# EAGLE schematic helium_pa3 (EAGLE 4.09)
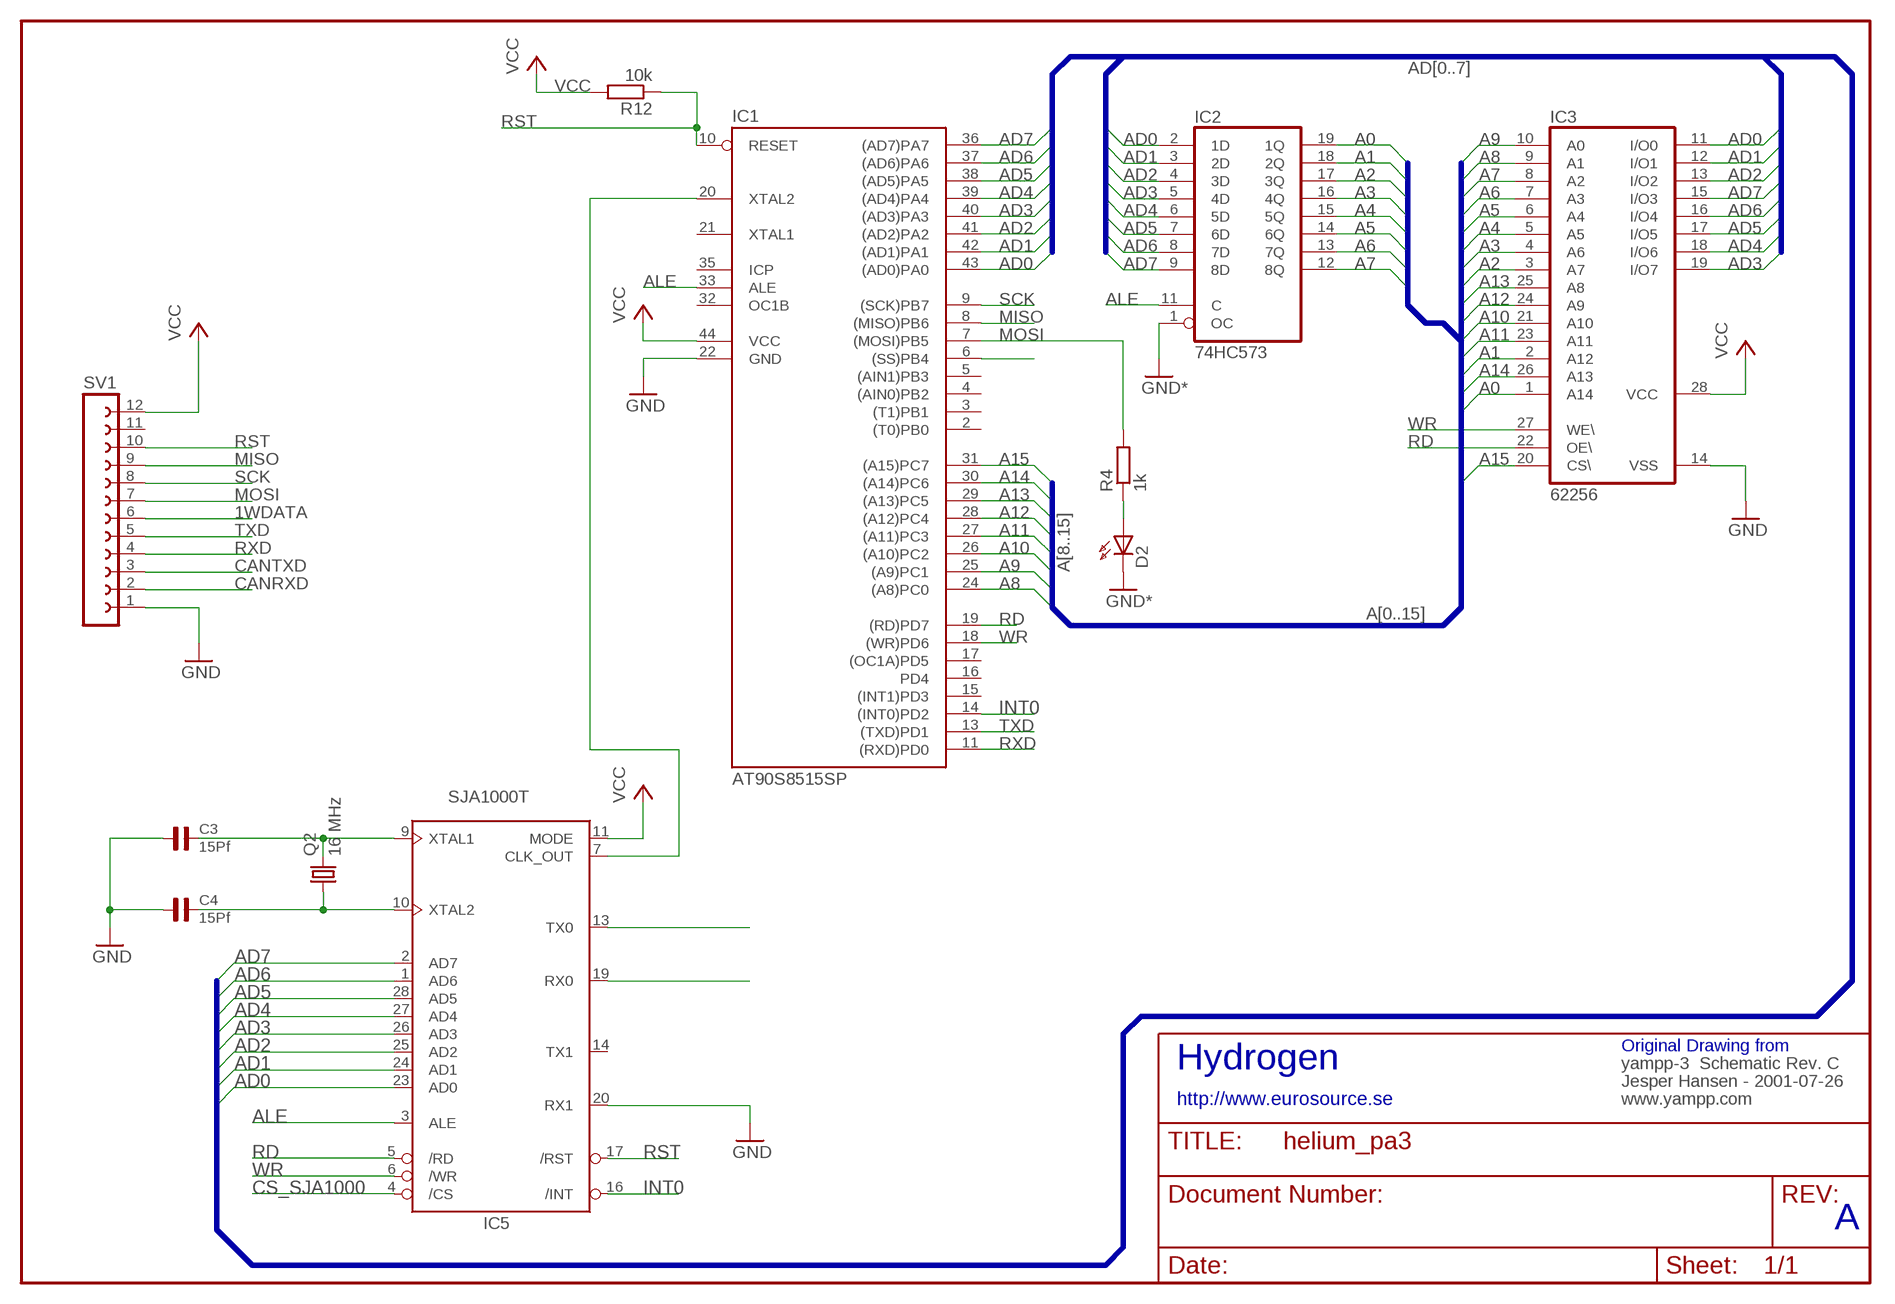
[diagram p0: schematic, sheet 1]

## Parts
C3  15Pf  C0805  [C0805]
C4  15Pf  C0805  [C0805]
D2  EL17-21LED0805  [LED0805]
IC1  AT90S8515SP  [PLCC-44-JESPER]
IC2  74HC573  74573  [SO20L]
IC3  62256  62256P  [SO28L]
IC5  SJA1000T  [SO-28L]
Q2  16 MHz  CRYTALHC49S  [HC49/S]
R4  1k  R-EU_M0805  [M0805]
R12  10k  R-EU_M0805  [M0805]
SV1  FE12-1  [FE12]

## Nets
1WDATA: SV1.6
A0: IC2.19(1Q) IC3.1(A14)
A1: IC2.18(2Q) IC3.2(A12)
A2: IC2.17(3Q) IC3.3(A7)
A3: IC2.16(4Q) IC3.4(A6)
A4: IC2.15(5Q) IC3.5(A5)
A5: IC2.14(6Q) IC3.6(A4)
A6: IC2.13(7Q) IC3.7(A3)
A7: IC2.12(8Q) IC3.8(A2)
A8: IC1.24((A8)PC0) IC3.9(A1)
A9: IC1.25((A9)PC1) IC3.10(A0)
A10: IC1.26((A10)PC2) IC3.21(A10)
A11: IC1.27((A11)PC3) IC3.23(A11)
A12: IC1.28((A12)PC4) IC3.24(A9)
A13: IC1.29((A13)PC5) IC3.25(A8)
A14: IC1.30((A14)PC6) IC3.26(A13)
A15: IC1.31((A15)PC7) IC3.20(CS\)
AD0: IC1.43((AD0)PA0) IC2.2(1D) IC3.11(I/O0) IC5.23(AD0)
AD1: IC1.42((AD1)PA1) IC2.3(2D) IC3.12(I/O1) IC5.24(AD1)
AD2: IC1.41((AD2)PA2) IC2.4(3D) IC3.13(I/O2) IC5.25(AD2)
AD3: IC1.40((AD3)PA3) IC2.5(4D) IC3.19(I/O7) IC5.26(AD3)
AD4: IC1.39((AD4)PA4) IC2.6(5D) IC3.18(I/O6) IC5.27(AD4)
AD5: IC1.38((AD5)PA5) IC2.7(6D) IC3.17(I/O5) IC5.28(AD5)
AD6: IC1.37((AD6)PA6) IC2.8(7D) IC3.16(I/O4) IC5.1(AD6)
AD7: IC1.36((AD7)PA7) IC2.9(8D) IC3.15(I/O3) IC5.2(AD7)
ALE: IC1.33(ALE) IC2.11(C) IC5.3(ALE)
CANRXD: SV1.2
CANTXD: SV1.3
CS_SJA1000: IC1.6((SS)PB4) IC5.4(/CS)
GND [power]: C3.1 C4.1 D2.2(C) IC2.1(OC) IC3.14(VSS) IC5.20(RX1) SV1.1 ; supply symbol labelled GND*
INT0: IC1.14((INT0)PD2) IC5.16(/INT)
MISO: IC1.8((MISO)PB6) SV1.9
MOSI: IC1.7((MOSI)PB5) R4.2 SV1.7
N$1: IC1.22(GND) ; supply symbol labelled GND
N$2: C4.2 IC5.10(XTAL2) Q2.1
N$3: C3.2 IC5.9(XTAL1) Q2.2
N$4: IC3.28(VCC) ; supply symbol labelled VCC
N$5: IC1.44(VCC) ; supply symbol labelled VCC
N$6: D2.1(A) R4.1
N$7: IC1.20(XTAL2) IC5.7(CLK_OUT)
N$8: IC5.11(MODE) ; supply symbol labelled VCC
N$9: IC5.13(TX0)
N$10: IC5.19(RX0)
RD: IC1.19((RD)PD7) IC3.22(OE\) IC5.5(/RD)
RST: IC1.10(RESET) IC5.17(/RST) R12.1 SV1.10
RXD: IC1.11((RXD)PD0) SV1.4
SCK: IC1.9((SCK)PB7) SV1.8
TXD: IC1.13((TXD)PD1) SV1.5
VCC [power]: R12.2 SV1.12
WR: IC1.18((WR)PD6) IC3.27(WE\) IC5.6(/WR)
Unconnected: IC1.1(NC1) IC1.2((T0)PB0) IC1.3((T1)PB1) IC1.4((AIN0)PB2) IC1.5((AIN1)PB3) IC1.12(NC2) IC1.15((INT1)PD3) IC1.16(PD4) IC1.17((OC1A)PD5) IC1.21(XTAL1) IC1.23(NC3) IC1.32(OC1B) IC1.34(NC4) IC1.35(ICP) IC5.14(TX1) SV1.11

## Buses
AD[0..7]
A[8..15]
A[0..7]
A[0..15]

## Notes on the sheet
- Original Drawing from
- Hydrogen | yampp-3  Schematic Rev. C
- Jesper Hansen - 2001-07-26
- http://www.eurosource.se | www.yampp.com
- A

## Power pins joined to a net without a drawn wire
GND: IC2.10(GND)
VCC: IC2.20(VCC)
VDD: IC5.12(VDD) IC5.18(VDD) IC5.22(VDD)
VSS: IC5.8(VSS) IC5.15(VSS) IC5.21(VSS)

## Library data of the parts
C3 C4 = SMD-SORT:C0805
D2 = led:EL17-21: Everlight EL17-21
IC1 = atmel:AT90S8515: MICROCONTROLLER 8 Kbytes FLASH 512 bytes SRAM 512 bytes EEPROM UART
IC2 = 74XX:74573
IC3 = MEMHITCH:62256P
IC5 = micro-philips:SJA1000: BASIC-CAN 2.0a Controller (former 82C200) Stand-alone CAN controller
Q2 = crystal:CRYTAL: CRYSTAL
R4 R12 = rcl:R-EU_: RESISTOR, European symbol
SV1 = con-lsta:FE12-1: FEMALE HEADER

## Net classes
0 default: width 0.25 mm, drill 0.3 mm, clearance 0.6 mm
1 power: width 0.4 mm, drill 0.3 mm, clearance 0.6 mm